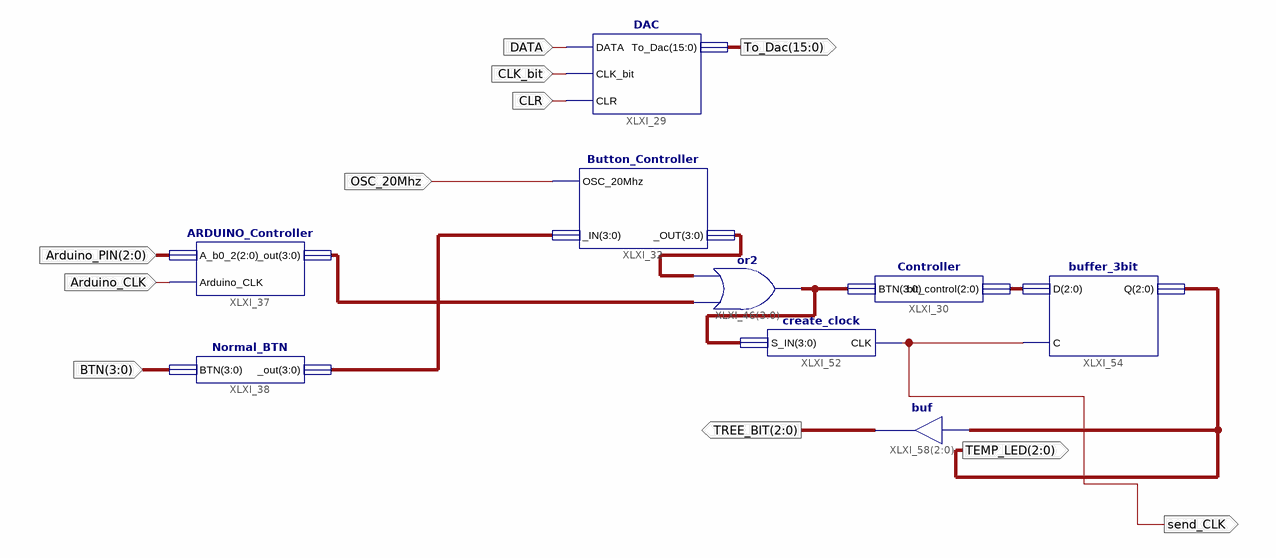
[diagram p0: schematic sheet 1]
// Xilinx ISE schematic Main.sch (spartan6) as structural Verilog: 9 symbols, 11 ports
module Main (
  input  DATA,
  input  CLK_bit,
  input  CLR,
  input  OSC_20Mhz,
  input  [2:0] Arduino_PIN,
  input  Arduino_CLK,
  input  [3:0] BTN,
  output [15:0] To_Dac,
  output [2:0] TREE_BIT,
  output send_CLK,
  output [2:0] TEMP_LED
);

  wire [2:0] XLXN_208;
  wire [3:0] XLXN_175, XLXN_176, XLXN_177, XLXN_178;

  DAC XLXI_29 (.DATA(DATA), .CLK_bit(CLK_bit), .CLR(CLR), .To_Dac(To_Dac));
  ARDUINO_Controller XLXI_37 (.A_b0_2(Arduino_PIN), .Arduino_CLK(Arduino_CLK), ._out(XLXN_178));
  Normal_BTN XLXI_38 (.BTN(BTN), ._out(XLXN_175));
  Button_Controller XLXI_32 (.OSC_20Mhz(OSC_20Mhz), ._IN(XLXN_175), ._OUT(XLXN_177));
  assign XLXN_176 = XLXN_178 | XLXN_177;  // or2 XLXI_46[3..0], 4 bits wide
  Controller XLXI_30 (.BTN(XLXN_176), .bit_control(XLXN_208));
  buffer_3bit XLXI_54 (.D(XLXN_208), .C(send_CLK), .Q(TEMP_LED));
  create_clock XLXI_52 (.S_IN(XLXN_176), .CLK(send_CLK));
  assign TREE_BIT = TEMP_LED;  // buf XLXI_58[2..0], 3 bits wide

  // Notes on the sheet:
  //   CLOCK_DEDICATED_ROUTE on signal CLK_bit = FALSE
endmodule
